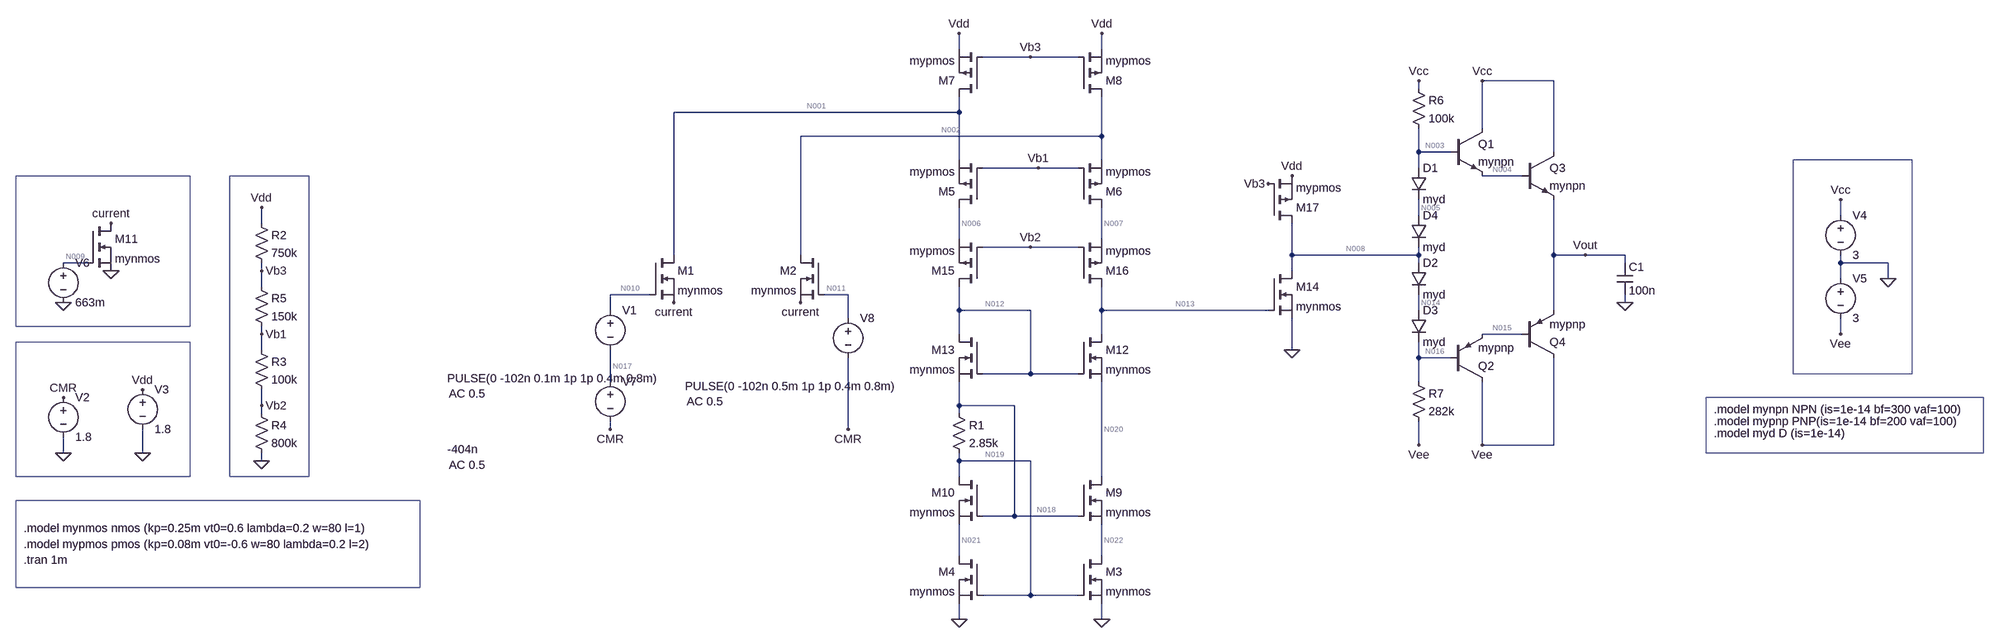
[diagram p0: schematic project2.asc]
project2.asc, the LTspice schematic file:
Version 4
SHEET 1 4108 1572
WIRE 1472 176 1472 144
WIRE 1760 176 1760 144
WIRE 1616 192 1520 192
WIRE 1712 192 1616 192
WIRE 2672 240 2528 240
WIRE 2400 256 2400 240
WIRE 1472 304 1472 272
WIRE 1472 304 896 304
WIRE 2528 336 2528 240
WIRE 1760 352 1760 272
WIRE 1760 352 1152 352
WIRE 2400 384 2400 336
WIRE 2464 384 2400 384
WIRE 2672 384 2672 240
WIRE 1472 400 1472 304
WIRE 1760 400 1760 352
WIRE 1632 416 1520 416
WIRE 1712 416 1632 416
WIRE 2400 416 2400 384
WIRE 2608 432 2528 432
WIRE 2400 512 2400 480
WIRE 3808 512 3808 480
WIRE 64 528 64 496
WIRE 1472 560 1472 496
WIRE 1760 560 1760 496
WIRE 1616 576 1520 576
WIRE 1712 576 1616 576
WIRE 896 592 896 304
WIRE 1152 592 1152 352
WIRE 2144 592 2144 528
WIRE 2400 592 2400 576
WIRE 2400 592 2144 592
WIRE 2672 592 2672 480
WIRE 2736 592 2672 592
WIRE 2816 592 2736 592
WIRE -288 608 -336 608
WIRE 2400 608 2400 592
WIRE 2816 608 2816 592
WIRE 3808 608 3808 592
WIRE 3904 608 3808 608
WIRE 64 624 64 608
WIRE 2144 624 2144 592
WIRE 3808 640 3808 608
WIRE 3904 640 3904 608
WIRE 64 656 64 624
WIRE 848 672 768 672
WIRE 1248 672 1200 672
WIRE 2816 688 2816 672
WIRE 768 704 768 672
WIRE 1472 704 1472 656
WIRE 1616 704 1472 704
WIRE 1760 704 1760 656
WIRE 2096 704 1760 704
WIRE 2400 704 2400 672
WIRE 2672 704 2672 592
WIRE 1248 720 1248 672
WIRE 64 752 64 736
WIRE 1472 752 1472 704
WIRE 1760 752 1760 704
WIRE 2608 752 2528 752
WIRE 3808 752 3808 720
WIRE 64 784 64 752
WIRE 2144 784 2144 720
WIRE 2400 800 2400 768
WIRE 2464 800 2400 800
WIRE 1616 832 1616 704
WIRE 1616 832 1520 832
WIRE 1712 832 1616 832
WIRE 768 848 768 784
WIRE 2400 848 2400 800
WIRE 64 896 64 864
WIRE 1472 896 1472 848
WIRE 1584 896 1472 896
WIRE 64 912 64 896
WIRE 1472 912 1472 896
WIRE 768 944 768 928
WIRE 1248 944 1248 800
WIRE 2400 976 2400 928
WIRE 2528 976 2528 848
WIRE 2672 976 2672 800
WIRE 2672 976 2528 976
WIRE -336 992 -336 960
WIRE -176 992 -176 944
WIRE 64 1008 64 992
WIRE 1472 1008 1472 992
WIRE 1616 1008 1472 1008
WIRE 1472 1040 1472 1008
WIRE 1760 1040 1760 848
WIRE 1584 1120 1584 896
WIRE 1584 1120 1520 1120
WIRE 1712 1120 1584 1120
WIRE 1472 1200 1472 1136
WIRE 1760 1200 1760 1136
WIRE 1616 1280 1616 1008
WIRE 1616 1280 1520 1280
WIRE 1712 1280 1616 1280
WIRE 1472 1328 1472 1296
WIRE 1760 1328 1760 1296
FLAG 1472 1328 0
FLAG 1760 1328 0
FLAG 1472 144 Vdd
FLAG 1760 144 Vdd
FLAG -336 992 0
FLAG -336 880 CMR
FLAG 1248 944 CMR
FLAG -176 992 0
FLAG -176 864 Vdd
FLAG -240 624 0
FLAG -336 688 0
FLAG 896 688 current
FLAG 1152 688 current
FLAG -240 528 current
FLAG 2144 784 0
FLAG 2144 432 Vdd
FLAG 64 496 Vdd
FLAG 64 1008 0
FLAG 64 752 Vb1
FLAG 1632 416 Vb1
FLAG 64 896 Vb2
FLAG 1616 576 Vb2
FLAG 64 624 Vb3
FLAG 1616 192 Vb3
FLAG 2096 448 Vb3
FLAG 2816 688 0
FLAG 3904 640 0
FLAG 3808 480 Vcc
FLAG 2528 240 Vcc
FLAG 2528 976 Vee
FLAG 3808 752 Vee
FLAG 2400 240 Vcc
FLAG 2400 976 Vee
FLAG 2736 592 Vout
FLAG 768 944 CMR
DATAFLAG 2144 592 ""
DATAFLAG 1808 704 ""
DATAFLAG 1760 1168 ""
DATAFLAG 1760 960 ""
DATAFLAG 1760 352 ""
DATAFLAG 1760 528 ""
DATAFLAG 2672 592 ""
SYMBOL nmos 848 592 R0
SYMATTR InstName M1
SYMATTR Value mynmos
SYMBOL nmos 1200 592 M0
SYMATTR InstName M2
SYMATTR Value mynmos
SYMBOL nmos 1712 1200 R0
SYMATTR InstName M3
SYMATTR Value mynmos
SYMBOL nmos 1520 1200 M0
SYMATTR InstName M4
SYMATTR Value mynmos
SYMBOL pmos 1520 496 R180
SYMATTR InstName M5
SYMATTR Value mypmos
SYMBOL pmos 1712 496 M180
SYMATTR InstName M6
SYMATTR Value mypmos
SYMBOL pmos 1520 272 R180
SYMATTR InstName M7
SYMATTR Value mypmos
SYMBOL pmos 1712 272 M180
SYMATTR InstName M8
SYMATTR Value mypmos
SYMBOL voltage -336 864 R0
WINDOW 123 0 0 Left 0
WINDOW 39 0 0 Left 0
SYMATTR InstName V2
SYMATTR Value 1.8
SYMBOL voltage -176 848 R0
WINDOW 123 0 0 Left 0
WINDOW 39 0 0 Left 0
SYMATTR InstName V3
SYMATTR Value 1.8
SYMBOL nmos 1712 1040 R0
SYMATTR InstName M9
SYMATTR Value mynmos
SYMBOL nmos 1520 1040 M0
SYMATTR InstName M10
SYMATTR Value mynmos
SYMBOL pmos 1520 656 R180
SYMATTR InstName M15
SYMATTR Value mypmos
SYMBOL pmos 1712 656 M180
SYMATTR InstName M16
SYMATTR Value mypmos
SYMBOL nmos -288 528 R0
SYMATTR InstName M11
SYMATTR Value mynmos
SYMBOL voltage -336 592 R0
WINDOW 123 0 0 Left 0
WINDOW 39 0 0 Left 0
SYMATTR InstName V6
SYMATTR Value 663m
SYMBOL res 1456 896 R0
SYMATTR InstName R1
SYMATTR Value 2.85k
SYMBOL nmos 1712 752 R0
SYMATTR InstName M12
SYMATTR Value mynmos
SYMBOL nmos 1520 752 M0
SYMATTR InstName M13
SYMATTR Value mynmos
SYMBOL nmos 2096 624 R0
SYMATTR InstName M14
SYMATTR Value mynmos
SYMBOL pmos 2096 528 M180
SYMATTR InstName M17
SYMATTR Value mypmos
SYMBOL voltage 1248 704 R0
WINDOW 123 -326 184 Left 2
WINDOW 39 0 0 Left 0
WINDOW 3 -329 153 Left 2
SYMATTR Value2 AC 0.5
SYMATTR InstName V8
SYMATTR Value PULSE(0 -102n 0.5m 1p 1p 0.4m 0.8m)
SYMBOL res 48 512 R0
SYMATTR InstName R2
SYMATTR Value 750k
SYMBOL res 48 768 R0
SYMATTR InstName R3
SYMATTR Value 100k
SYMBOL res 48 896 R0
SYMATTR InstName R4
SYMATTR Value 800k
SYMBOL res 48 640 R0
SYMATTR InstName R5
SYMATTR Value 150k
SYMBOL npn 2464 336 R0
SYMATTR InstName Q1
SYMATTR Value mynpn
SYMBOL pnp 2464 848 M180
SYMATTR InstName Q2
SYMATTR Value mypnp
SYMBOL diode 2384 608 R0
SYMATTR InstName D2
SYMATTR Value myd
SYMBOL npn 2608 384 R0
SYMATTR InstName Q3
SYMATTR Value mynpn
SYMBOL pnp 2608 800 M180
SYMATTR InstName Q4
SYMATTR Value mypnp
SYMBOL diode 2384 704 R0
SYMATTR InstName D3
SYMATTR Value myd
SYMBOL diode 2384 416 R0
SYMATTR InstName D1
SYMATTR Value myd
SYMBOL diode 2384 512 R0
SYMATTR InstName D4
SYMATTR Value myd
SYMBOL cap 2800 608 R0
SYMATTR InstName C1
SYMATTR Value 100n
SYMBOL voltage 3808 496 R0
WINDOW 123 0 0 Left 0
WINDOW 39 0 0 Left 0
SYMATTR InstName V4
SYMATTR Value 3
SYMBOL voltage 3808 624 R0
WINDOW 123 0 0 Left 0
WINDOW 39 0 0 Left 0
SYMATTR InstName V5
SYMATTR Value 3
SYMBOL res 2384 240 R0
SYMATTR InstName R6
SYMATTR Value 100k
SYMBOL res 2384 832 R0
SYMATTR InstName R7
SYMATTR Value 282k
SYMBOL voltage 768 688 R0
WINDOW 123 -326 184 Left 2
WINDOW 39 0 0 Left 0
WINDOW 3 -329 153 Left 2
SYMATTR Value2 AC 0.5
SYMATTR InstName V1
SYMATTR Value PULSE(0 -102n 0.1m 1p 1p 0.4m 0.8m)
SYMBOL voltage 768 832 R0
WINDOW 123 -326 184 Left 2
WINDOW 39 0 0 Left 0
WINDOW 3 -329 153 Left 2
SYMATTR Value2 AC 0.5
SYMATTR InstName V7
SYMATTR Value -404n
TEXT -416 1144 Left 2 !.model mynmos nmos (kp=0.25m vt0=0.6 lambda=0.2 w=80 l=1)
TEXT -416 1176 Left 2 !.model mypmos pmos (kp=0.08m vt0=-0.6 w=80 lambda=0.2 l=2)
TEXT -416 1208 Left 2 !.tran 1m
TEXT 3552 904 Left 2 !.model mynpn NPN (is=1e-14 bf=300 vaf=100)
TEXT 3552 928 Left 2 !.model mypnp PNP(is=1e-14 bf=200 vaf=100)
TEXT 3552 952 Left 2 !.model myd D (is=1e-14)
RECTANGLE Normal -432 1040 -80 768
RECTANGLE Normal -432 432 -80 736
RECTANGLE Normal 160 1040 0 432
RECTANGLE Normal 384 1264 -432 1088
RECTANGLE Normal 3952 832 3712 400
RECTANGLE Normal 4096 992 3536 880

The netlist it stands for:
* project2.asc
M1 N001 N010 current current mynmos
M2 N002 N011 current current mynmos
M3 N022 N019 0 0 mynmos
M4 N021 N019 0 0 mynmos
M5 N006 Vb1 N001 N001 mypmos
M6 N007 Vb1 N002 N002 mypmos
M7 N001 Vb3 Vdd Vdd mypmos
M8 N002 Vb3 Vdd Vdd mypmos
V2 CMR 0 1.8
V3 Vdd 0 1.8
M9 N020 N018 N022 N022 mynmos
M10 N019 N018 N021 N021 mynmos
M15 N012 Vb2 N006 N006 mypmos
M16 N013 Vb2 N007 N007 mypmos
M11 current N009 0 0 mynmos
V6 N009 0 663m
R1 N018 N019 2.85k
M12 N013 N012 N020 N020 mynmos
M13 N012 N012 N018 N018 mynmos
M14 N008 N013 0 0 mynmos
M17 N008 Vb3 Vdd Vdd mypmos
V8 N011 CMR PULSE(0 -102n 0.5m 1p 1p 0.4m 0.8m) AC 0.5
R2 Vdd Vb3 750k
R3 Vb1 Vb2 100k
R4 Vb2 0 800k
R5 Vb3 Vb1 150k
Q1 Vcc N003 N004 0 mynpn
Q2 Vee N016 N015 0 mypnp
D2 N008 N014 myd
Q3 Vcc N004 Vout 0 mynpn
Q4 Vee N015 Vout 0 mypnp
D3 N014 N016 myd
D1 N003 N005 myd
D4 N005 N008 myd
C1 Vout 0 100n
V4 Vcc 0 3
V5 0 Vee 3
R6 Vcc N003 100k
R7 N016 Vee 282k
V1 N010 N017 PULSE(0 -102n 0.1m 1p 1p 0.4m 0.8m) AC 0.5
V7 N017 CMR -404n AC 0.5
.model D D
.lib standard.dio
.model NPN NPN
.model PNP PNP
.lib standard.bjt
.model NMOS NMOS
.model PMOS PMOS
.lib standard.mos
.model mynmos nmos (kp=0.25m vt0=0.6 lambda=0.2 w=80 l=1)
.model mypmos pmos (kp=0.08m vt0=-0.6 w=80 lambda=0.2 l=2)
.tran 1m
.model mynpn NPN (is=1e-14 bf=300 vaf=100)
.model mypnp PNP(is=1e-14 bf=200 vaf=100)
.model myd D (is=1e-14)
.backanno
.end

* Results of the author's LTspice run, read from the files saved beside the schematic
* Operating Point, zero values left out:
*   V(n001) = 1.59 V
*   V(n010) = 1.8 V
*   V(current) = 1.153 V
*   V(n002) = 1.59 V
*   V(n011) = 1.8 V
*   V(n022) = 39.2 mV
*   V(n019) = 636 mV
*   V(n021) = 39.17 mV
*   V(n006) = 1.489 V
*   V(vb1) = 900 mV
*   V(n007) = 1.484 V
*   V(vb3) = 1.05 V
*   V(vdd) = 1.8 V
*   V(cmr) = 1.8 V
*   V(n020) = 647.8 mV
*   V(n018) = 673.4 mV
*   V(n012) = 1.307 V
*   V(vb2) = 800 mV
*   V(n013) = 660 mV
*   V(n009) = 663 mV
*   V(n008) = 906.6 mV
*   V(vcc) = 3 V
*   V(n003) = 1.98 V
*   V(n004) = 1.519 V
*   V(vee) = -3 V
*   V(n016) = -165.7 mV
*   V(n015) = 303.9 mV
*   V(n014) = 370.4 mV
*   V(vout) = 911.5 mV
*   V(n005) = 1.443 V
*   V(n017) = 1.8 V
*   Ic(Q4) = -164 µA
*   Ib(Q4) = -793.8 nA
*   Ie(Q4) = 164.8 µA
*   Ic(Q2) = -789.9 nA
*   Ib(Q2) = -3.838 nA
*   Ie(Q2) = 793.8 nA
*   Ic(Q3) = 164.3 µA
*   Ib(Q3) = 539.5 nA
*   Ie(Q3) = -164.8 µA
*   Ic(Q1) = 537.7 nA
*   Ib(Q1) = 1.774 nA
*   Ie(Q1) = -539.5 nA
*   Id(M17) = -42.43 µA
*   Is(M17) = 42.43 µA
*   Id(M16) = -13.1 µA
*   Is(M16) = 13.1 µA
*   Id(M15) = -13.1 µA
*   Is(M15) = 13.1 µA
*   Id(M8) = -37.52 µA
*   Is(M8) = 37.52 µA
*   Id(M7) = -37.52 µA
*   Is(M7) = 37.52 µA
*   Id(M6) = -13.1 µA
*   Is(M6) = 13.1 µA
*   Id(M5) = -13.1 µA
*   Is(M5) = 13.1 µA
*   Id(M14) = 42.59 µA
*   Is(M14) = -42.59 µA
*   Id(M13) = 13.1 µA
*   Is(M13) = -13.1 µA
*   Id(M12) = 13.1 µA
*   Is(M12) = -13.1 µA
*   Id(M11) = 48.84 µA
*   Ib(M11) = -1.163 pA
*   Is(M11) = -48.84 µA
*   Id(M10) = 13.1 µA
*   Is(M10) = -13.1 µA
*   Id(M9) = 13.1 µA
*   Is(M9) = -13.1 µA
*   Id(M4) = 13.1 µA
*   Is(M4) = -13.1 µA
*   Id(M3) = 13.1 µA
*   Is(M3) = -13.1 µA
*   Id(M2) = 24.42 µA
*   Is(M2) = -24.42 µA
*   Id(M1) = 24.42 µA
*   Is(M1) = -24.42 µA
*   I(D4) = 10.2 µA
*   I(D1) = 10.2 µA
*   I(D3) = 10.05 µA
*   I(D2) = 10.05 µA
*   I(R7) = 10.05 µA
*   I(R6) = 10.2 µA
*   I(R5) = 1 µA
*   I(R4) = 1 µA
*   I(R3) = 1 µA
*   I(R2) = 1 µA
*   I(R1) = 13.1 µA
*   I(V5) = -174.8 µA
*   I(V4) = -175 µA
*   I(V3) = -118.5 µA
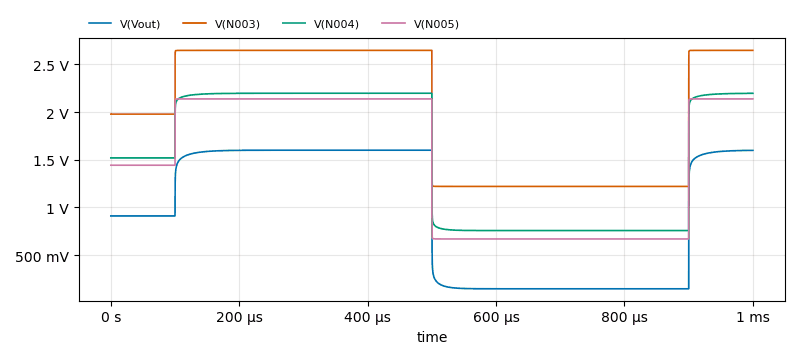
[diagram p1: Transient Analysis of project2.asc, plotted from the saved traces]
* Transient Analysis, 1 run:
*   V(Vout): min 147 mV, max 1.601 V, average 946.1 mV, rms 1.164 V, last 1.599 V
*   V(N003): min 1.221 V, max 2.648 V, average 2.01 V, rms 2.12 V, last 2.648 V
*   V(N004): min 757.9 mV, max 2.198 V, average 1.552 V, rms 1.692 V, last 2.197 V
*   V(N005): min 669.8 mV, max 2.139 V, average 1.482 V, rms 1.635 V, last 2.139 V